# EAGLE design RFM22 Shield-v10 (EAGLE 9.0.1)
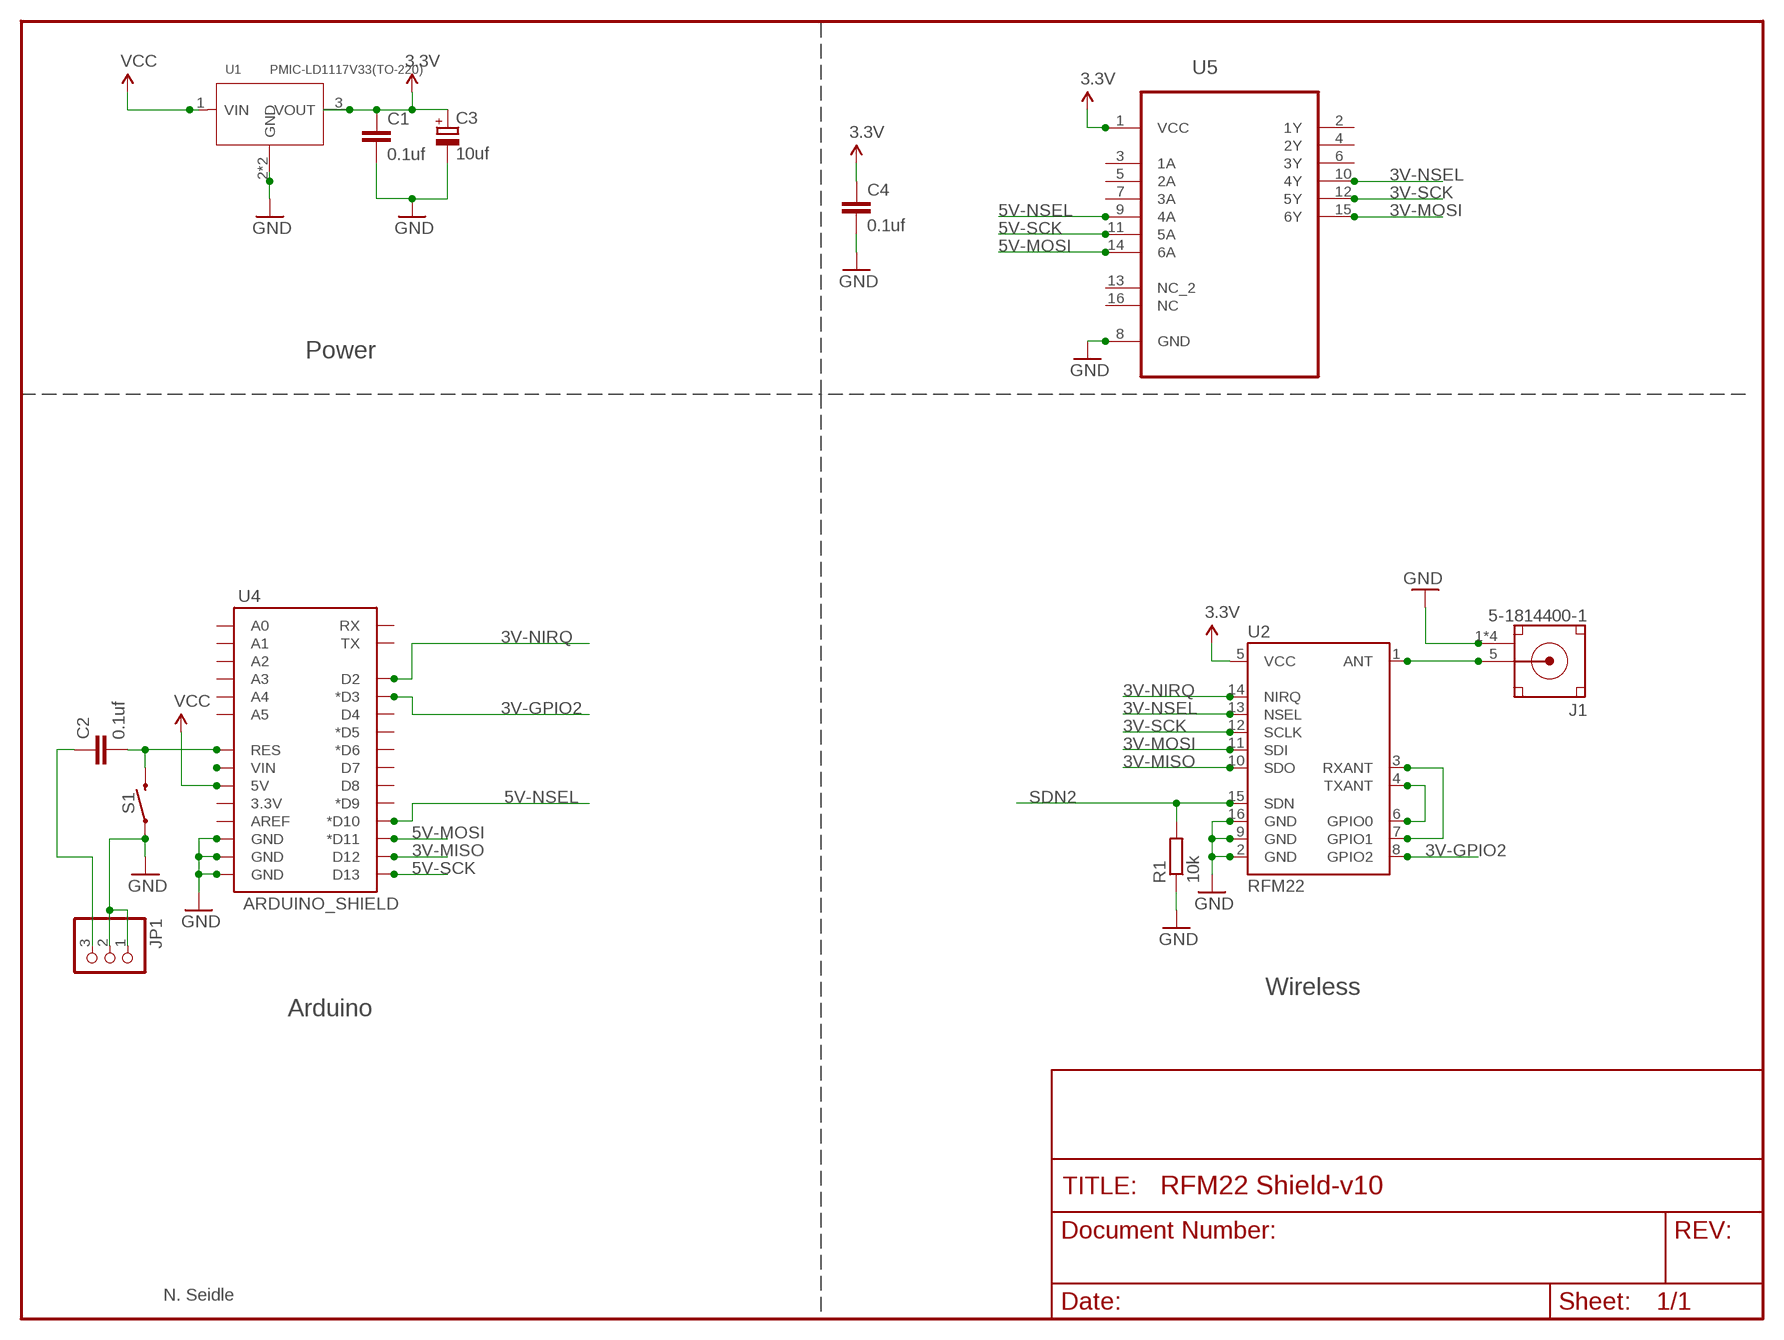
[diagram p0: schematic, sheet 1]

## Parts
C1  0.1uf  C-EU050-030X075  [C050-030X075]
C2  0.1uf  C-EU050-030X075  [C050-030X075]
C3  10uf  CPOL-EUE5-8.5  [E5-8,5]
C4  0.1uf  C-EU050-030X075  [C050-030X075]
J1  5-1814400-1  [CONN_5-1814400-1]
JP1  PINHD-1X3  [1X03]
R1  10k  R-EU_0207/10  [0207/10]
S1  MOMENTARY-SWITCH-SPST-PTH-6.0MM  [TACTILE_SWITCH_PTH_6.0MM]
U1  PMIC-LD1117V33(TO-220)  [TO-220]
U2  RFM22  RFM22SMD  [RFM22-XXX-S2]
U4  ARDUINO_SHIELD  ARDUINO_SHIELDNOHOLES  [DUEMILANOVE_SHIELD_NOHOLES]
U5  74HC4050N,652  [DIP254P762X420-16]

## Nets
3.3V: C1.1 C3.+ C4.1 U1.3(VOUT) U2.5(VCC) U5.1(VCC)
3V-GPIO2: U2.8(GPIO2) U4.D3(*D3)
3V-MISO: U2.10(SDO) U4.D12
3V-MOSI: U2.11(SDI) U5.15(6Y)
3V-NIRQ: U2.14(NIRQ) U4.D2
3V-NSEL: U2.13(NSEL) U5.10(4Y)
3V-SCK: U2.12(SCLK) U5.12(5Y)
5V-MOSI: U4.D11(*D11) U5.14(6A)
5V-NSEL: U4.D10(*D10) U5.9(4A)
5V-SCK: U4.D13 U5.11(5A)
ARST: C2.2 S1.3 U4.RES
GND: C1.2 C3.- C4.2 J1.1(GND) J1.2(GND) J1.3(GND) J1.4(GND) JP1.1 JP1.2 R1.1 S1.1 U1.2(GND) U1.HEAT(GND) U2.2(GND) U2.9(GND) U2.16(GND) U4.GND@0(GND) U4.GND@1(GND) U4.GND@2(GND) U5.8(GND)
N$1: J1.5(SIGNAL) U2.1(ANT)
N$2: U4.VIN
N$3: U2.4(TXANT) U2.6(GPIO0)
N$4: U2.3(RXANT) U2.7(GPIO1)
RES_HEAD: C2.1 JP1.3
SDN2: R1.2 U2.15(SDN)
VCC: U1.1(VIN) U4.5V
Unconnected: U4.3.3V U4.A0 U4.A1 U4.A2 U4.A3 U4.A4 U4.A5 U4.AREF U4.D4 U4.D5(*D5) U4.D6(*D6) U4.D7 U4.D8 U4.D9(*D9) U4.RX U4.TX U5.2(1Y) U5.3(1A) U5.4(2Y) U5.5(2A) U5.6(3Y) U5.7(3A) U5.13(NC_2) U5.16(NC)

## Notes on the sheet
- Power
- Wireless
- Arduino
- N. Seidle

## Library data of the parts
C1 C2 C4 = resistor:C-EU: CAPACITOR, European symbol
C3 = resistor:CPOL-EU: POLARIZED CAPACITOR, European symbol
J1 = 5-1814400-1:5-1814400-1: Conn SMA RCP 0Hz to 3GHz 50Ohm Solder RA Thru-Hole Gold Over Nickel Over Copper Bag; AVAILABILITY: Good; COMMENT: 5-1814400-1; DESCRIPTION: SMA R/A PCB Skt GZD; EU_ROHS_COMPLIANCE: Compliant; LINK: http://www.te.com/usa-en/product-5-1814400-1.html; MF: TE Connectivity; MP: 5-1814400-1; NUMBER_OF_POSITIONS: 1; PACKAGE: None; PRICE: 1.88 USD
JP1 = pinhead:PINHD-1X3: PIN HEADER
R1 = resistor:R-EU_: RESISTOR, European symbol
S1 = SparkFun-Switches:MOMENTARY-SWITCH-SPST: Momentary Switch (Pushbutton) - SPST Normally-open (NO) SPST momentary switches (buttons, pushbuttons). Variants PTH-12MM - 12mm square, through-hole Momentary Pushbutton Switch - 12mm Square <https://www.sparkfun.com/products/9190> (COM-09190) PTH-6.0MM, PTH-6.0MM-KIT - 6.0mm square, through-hole Mini Pushbutton Switch <https://www.sparkfun.com/products/97> (COM-00097) KIT package intended for soldering kit's - only one side of pads' copper is exposed. PTH-RIGHT-ANGLE-KIT - Right-angle, through-hole Right Angle Tactile Button <https://www.sparkfun.com/products/10791> - Used on SparkFun BigTime Watch Kit <https://www.sparkfun.com/products/11734> SMD-12MM - 12mm square, surface-mount Tactile Button - SMD (12mm) <https://www.sparkfun.com/products/12993> (COM-12993) Used on SparkFun PicoBoard <https://www.sparkfun.com/products/11888> SMD-4.5MM - 4.5mm Square Trackball Switch Used on SparkFun Blackberry Trackballer Breakout <https://www.sparkfun.com/products/13169> SMD-4.6MMX2.8MM - 4.60mm x 2.80mm, surface mount Used on SparkFun SAMD21 Mini Breakout <https://www.sparkfun.com/products/13664> SMD-5.2MM, SMD-5.2-REDUNDANT - 5.2mm square, surface-mount Mini Pushbutton Switch - SMD <https://www.sparkfun.com/products/8720> (COM-08720) Used on Arduino Pro Mini <https://www.sparkfun.com/products/11114> REDUNDANT package connects both switch circuits together SMD-6.0X3.5MM - 6.0 x 3.5mm, surface mount Momentary Reset Switch SMD <https://www.sparkfun.com/products/8229> (COM-08229) SMD-6.2MM-TALL - 6.2mm square, surface mount Tactile Button - SMD (6mm) <https://www.sparkfun.com/products/12992> Used on SparkFun Digital Sandbox <https://www.sparkfun.com/products/12651> SMD-RIGHT-ANGLE - Right-angle, surface mount Used on SparkFun Block for Intel® Edison - Arduino <https://www.sparkfun.com/products/13036>; PROD_ID: SWCH-08441; SF_SKU: COM-00097
U1 = PMIC-LD1117V33_TO-220_:PMIC-LD1117V33(TO-220): 310030025; AVAILABILITY: Good; DESCRIPTION: LD1117 Series 3.3 V 800 mA Low Drop Fixed Positive Voltage Regulator - TO-220; MF: STMicroelectronics; MP: LD1117V33; PACKAGE: TO-220 STMicroelectronics; PRICE: 0.29 USD
U2 = SparkFun:RFM22: Description: The RFM22 is a low-power, low cost radio that is capable of operating in the 434MHz and 900MHz open bands. It's frequency is software defined and there are some very good libraries written for it.
U4 = SparkFun:ARDUINO_SHIELD
U5 = 74HC4050N_652:74HC4050N,652: Hex high-to-low level shifter; AVAILABILITY: Warning; DESCRIPTION: 74HC Series 6 V Surface Mount Hex High-to-Low Level Shifter - DIP-16; MF: NXP Semiconductors; MP: 74HC4050N,652; PACKAGE: DIP-16 NXP Semiconductors; PRICE: 0.44 USD

## Board
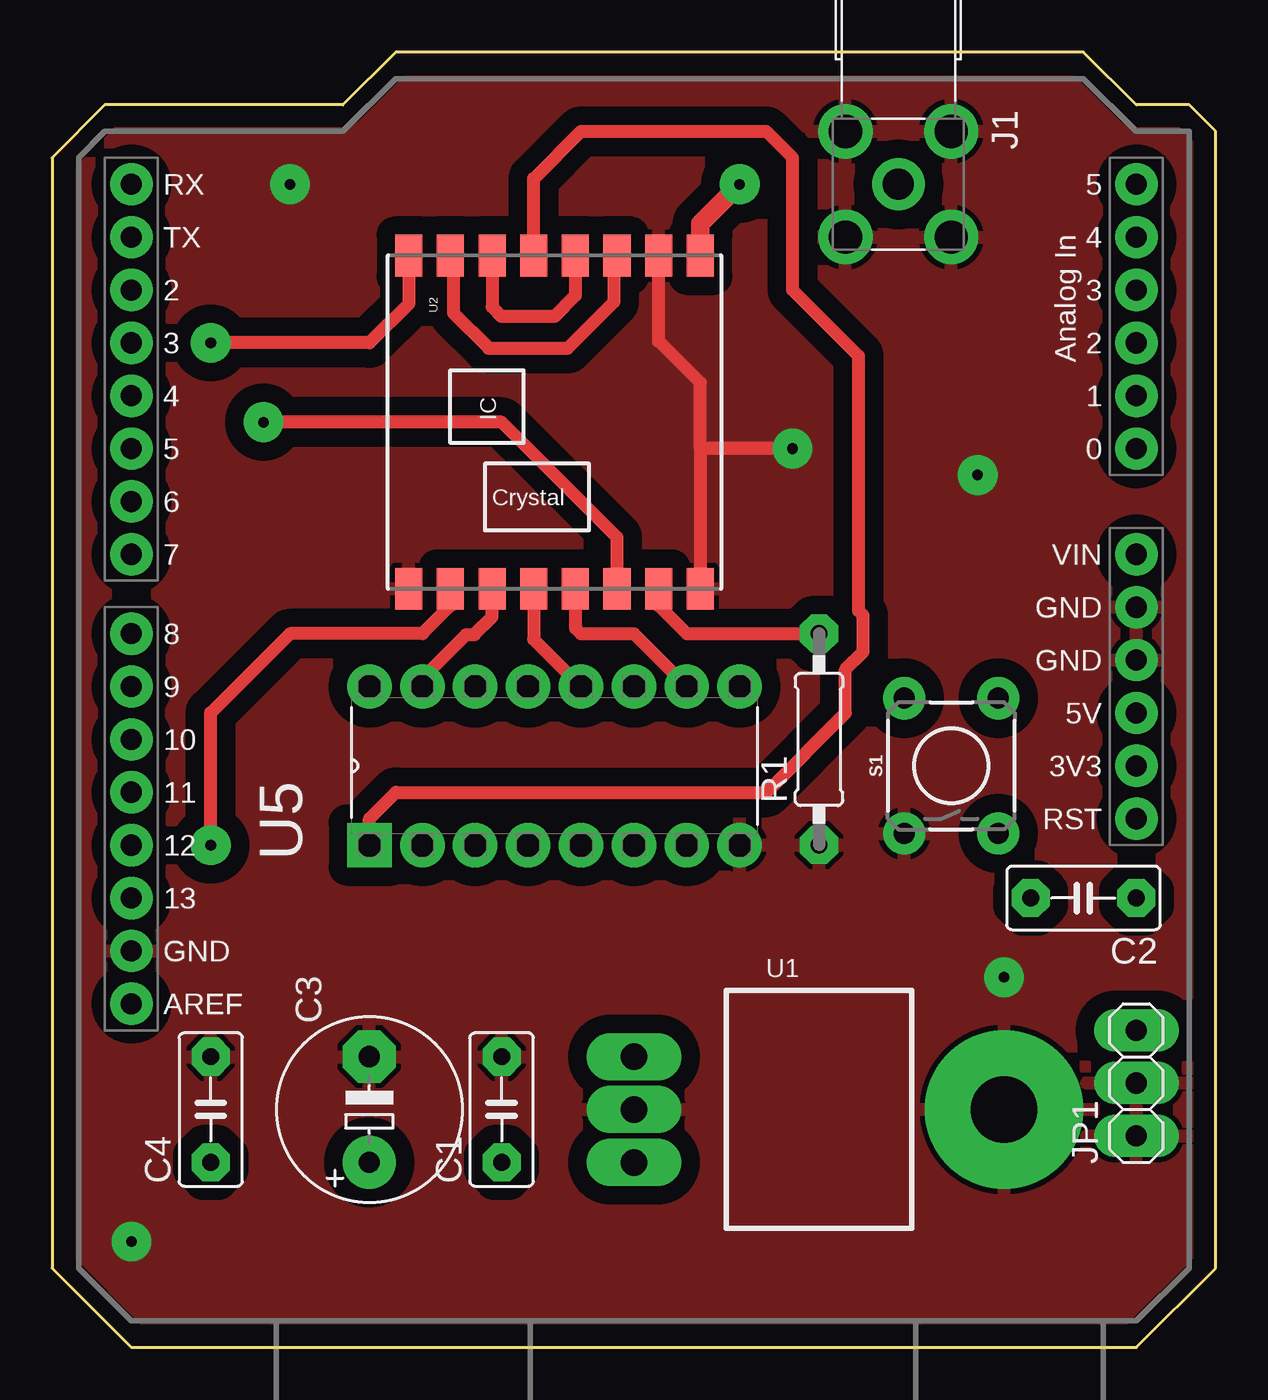
[diagram p1: board, top side]
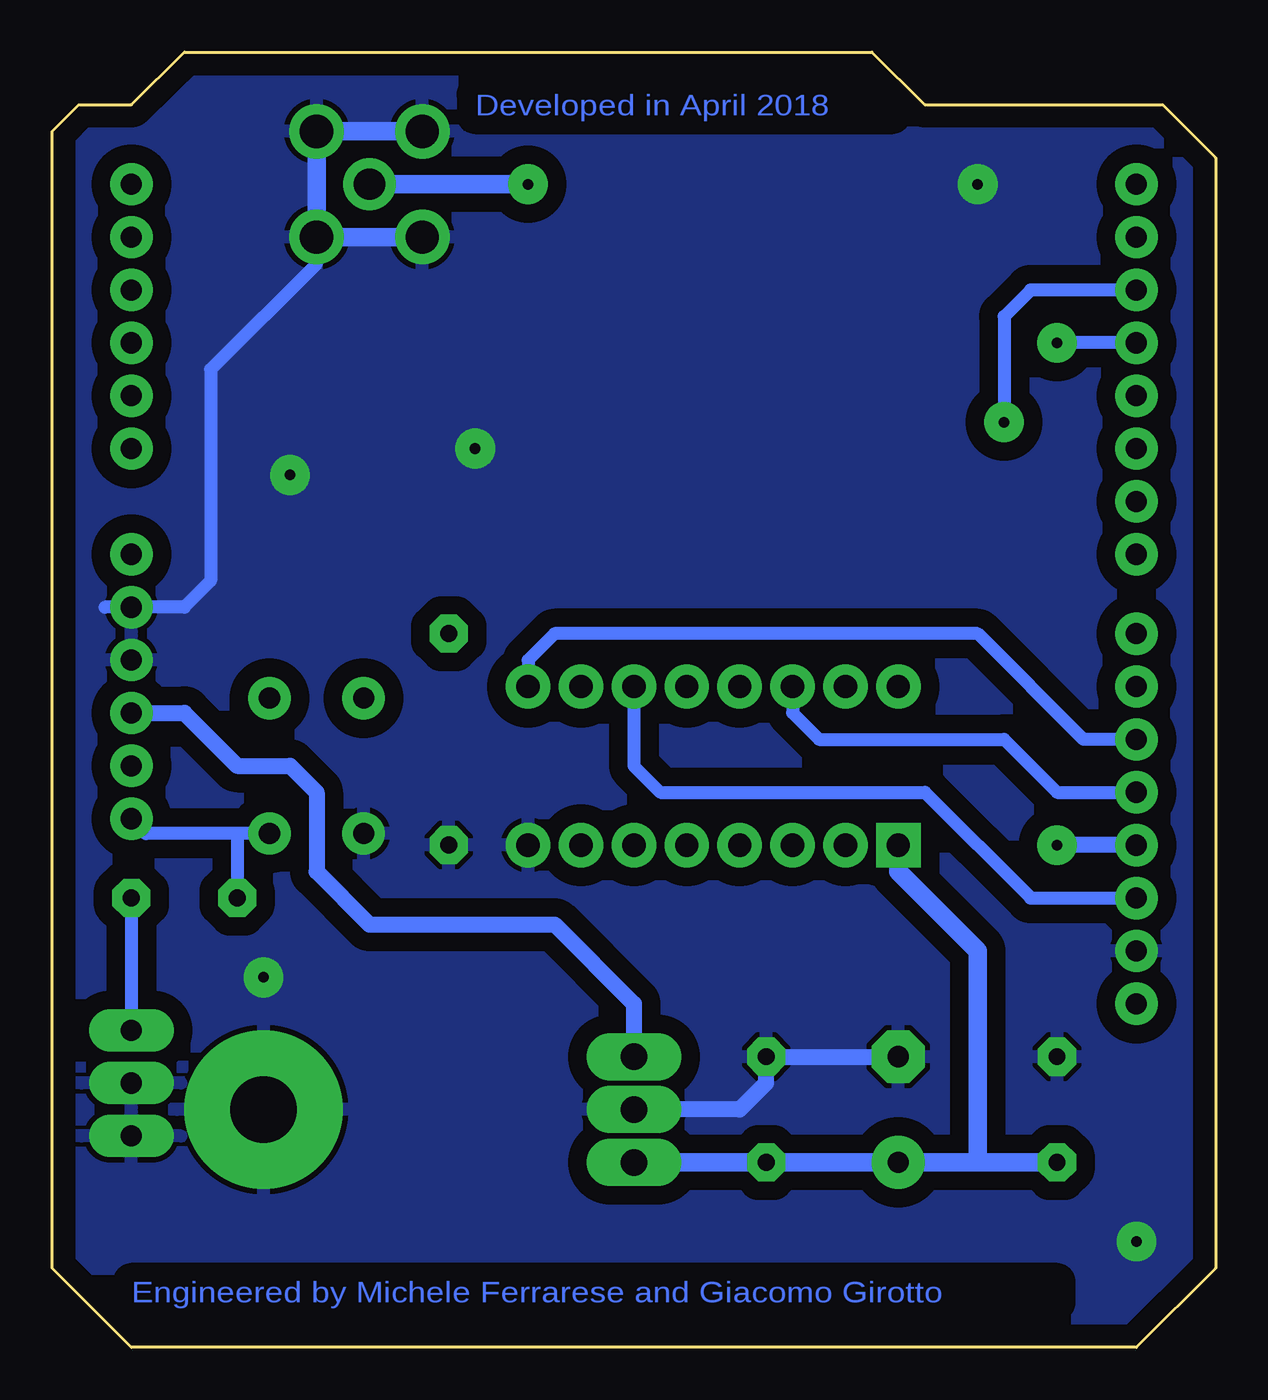
[diagram p2: board, bottom side, seen from below]

Size 55.88 x 62.23 mm. Coordinates in mm from the lower left corner, seen from the top.
Outline: 0,3.81 3.81,0 52.07,0 55.88,3.81 55.88,58.42 54.61,59.69 52.07,59.69 49.53,62.23 16.51,62.23 13.97,59.69 2.54,59.69 0,57.15 0,3.81
Copper layers (1*16): Top 0.035mm / dielectric 1.5mm / Bottom 0.035mm
Design rules "default *": minimum track width 6mil, minimum drill 0.35mm, track to track 35mil, track to pad 35mil, pad to pad 6mil, via to via 6mil, smd to smd 6mil, copper to edge 40mil, drill to drill 6mil, minimum pad ring 35mil, minimum via ring 8mil, stop-mask expansion 4mil, vias tented up to drill 0mil, thermal gap 10mil

### Footprints (pad centres in the part's own frame; a part is rotated, then mirrored left to right if it is on the bottom)
C050-030X075 = drill 0.813 octagon: 1 -2.54,0; 2 2.54,0
E5-8,5 = drill 1.016 pad 2.54: + -2.54,0 | drill 1.016 pad 2.54 octagon: - 2.54,0
CONN_5-1814400-1 = drill 1.6: 1 2.54,2.54; 2 -2.54,2.54; 3 -2.54,-2.54; 4 2.54,-2.54 | drill 1.5: 5 0,0
1X03 = drill 1.016 long: 1 -2.54,0; 2 0,0; 3 2.54,0
0207/10 = drill 0.813 octagon: 1 -5.08,0; 2 5.08,0
TACTILE_SWITCH_PTH_6.0MM = drill 1.016 pad 1.88: 1 -3.251,2.261; 2 3.251,2.261; 3 -3.251,-2.261; 4 3.251,-2.261
TO-220 = drill 1.27 pad 2.032 long: 1 -2.54,-11.43; 2 0,-11.43; 3 2.54,-11.43 | drill 3.2 pad 7.62: HEAT 0,6.35
RFM22-XXX-S2 = smd 2 x 1.3: 1 -8,7; 2 -8,5; 3 -8,3; 4 -8,1; 5 -8,-1; 6 -8,-3; 7 -8,-5; 8 -8,-7; 9 8,-7; 10 8,-5; 11 8,-3; 12 8,-1; 13 8,1; 14 8,3; 15 8,5; 16 8,7
DUEMILANOVE_SHIELD_NOHOLES = drill 1.016 pad 1.88: 3.3V 50.8,26.67; 5V 50.8,29.21; A0 50.8,41.91; A1 50.8,44.45; A2 50.8,46.99; A3 50.8,49.53; A4 50.8,52.07; A5 50.8,54.61; AREF 2.54,15.24; D2 2.54,49.53; D3 2.54,46.99; D4 2.54,44.45; D5 2.54,41.91; D6 2.54,39.37; D7 2.54,36.83; D8 2.54,33.02; D9 2.54,30.48; D10 2.54,27.94; D11 2.54,25.4; D12 2.54,22.86; D13 2.54,20.32; GND@0 50.8,31.75; GND@1 50.8,34.29; GND@2 2.54,17.78; RES 50.8,24.13; RX 2.54,54.61; TX 2.54,52.07; VIN 50.8,36.83
DIP254P762X420-16 = drill 1.118 square: 1 -7.62,17.78 | drill 1.118: 2 -7.62,15.24; 3 -7.62,12.7; 4 -7.62,10.16; 5 -7.62,7.62; 6 -7.62,5.08; 7 -7.62,2.54; 8 -7.62,0; 9 0,0; 10 0,2.54; 11 0,5.08; 12 0,7.62; 13 0,10.16; 14 0,12.7; 15 0,15.24; 16 0,17.78

### Placement (x,y rotation side)
C1  21.59,11.43 90 top
C2  49.53,21.59 180 top
C3  15.24,11.43 90 top
C4  7.62,11.43 90 top
J1  40.64,55.88 270 top
JP1  52.07,12.7 90 top
R1  36.83,29.21 90 top
S1  43.18,27.94 90 top
U1  39.37,11.43 270 top
U2  24.13,44.45 270 top
U4  1.27,1.27 0 top
U5  33.02,31.75 90 top

### Tracks (layer width: path | path; a pad name or v marks a point on that pad's centre or on a via)
3.3V
  Top 0.635: U5.1 15.24,25.4 16.51,26.67 34.29,26.67 38.1,30.48 38.1,32.56 38.95,33.41 38.95,35.17 38.73,35.38 38.73,47.62 35.56,50.8 35.56,57.15 34.29,58.42 25.4,58.42 23.13,56.15 U2.5
  Bottom 0.889: U1.3 C1.1 C3.+ 11.43,8.89 | 11.43,8.89 C4.1 | U5.1 15.24,22.86 11.43,19.05 11.43,8.89
3V-GPIO2  (via drill 0.51 pad 1.91)
  Top 0.635: v7.62,48.26 15.24,48.26 17.13,50.15 U2.8
  Bottom 0.635: U4.D3 v7.62,48.26
3V-MISO  (via drill 0.51 pad 1.91)
  Top 0.635: v7.62,24.13 7.62,30.48 11.43,34.29 17.78,34.29 19.13,35.64 U2.10
  Bottom 0.762: U4.D12 v7.62,24.13
3V-MOSI
  Top 0.152: 21.08,36.32 U2.11
  Top 0.635: U2.11 21.13,35.09 20.28,34.24 19.89,34.24 17.78,32.13 U5.15
3V-NIRQ  (via drill 0.51 pad 1.91)
  Top 0.635: v10.16,44.45 21.59,44.45 27.13,38.91 U2.14
  Bottom 0.635: U4.D2 8.89,50.8 10.16,49.53 v10.16,44.45
3V-NSEL
  Top 0.635: U2.13 25.13,34.56 25.4,34.29 27.94,34.29 U5.10
3V-SCK
  Top 0.635: U2.12 23.13,34.02 U5.12
5V-MOSI
  Bottom 0.635: U5.14 20.32,30.48 19.05,29.21 10.16,29.21 7.62,26.67 U4.D11
5V-NSEL
  Bottom 0.635: U4.D10 6.35,29.21 11.43,34.29 31.75,34.29 33.02,33.02 U5.9
5V-SCK
  Bottom 0.635: U5.11 27.94,27.94 26.67,26.67 13.97,26.67 8.89,21.59 U4.D13
ARST
  Bottom 0.635: S1.3 46.99,24.69 | 46.99,24.69 51.36,24.69 U4.RES | 46.99,24.69 C2.2
GND  (via drill 0.51 pad 1.91)
  Top 0.635: U2.2 29.13,48.34 31.13,46.34 31.13,43.18 | 31.13,43.18 U2.16 | 29.21,52.45 U2.2 | U2.2 29.13,52.21 28.99,52.07 28.99,52.45 U2.2 | v35.56,43.18 31.13,43.18
  Bottom 0.635: J1.1 43.18,52.07 48.26,46.99 48.26,36.83 49.53,35.56 U4.GND@1 53.34,35.56
  Bottom 0.762: U1.2 22.86,11.43 21.59,12.7 C1.2 C3.-
  Bottom 0.889: J1.3 J1.2 J1.1 J1.4
  other vias: 11.43,55.88 3.81,5.08 45.72,17.78 44.45,41.91
  pour Bottom (isolate 0.61, rank 3): 2.54,58.42 35.56,58.42 35.56,60.96 49.53,60.96 52.07,58.42 54.61,58.42 54.61,3.81 7.62,3.81 7.62,1.27 3.81,1.27 1.27,3.81 1.27,57.15
  pour Top (isolate 0.254, rank 4): 16.51,60.96 49.53,60.96 52.07,58.42 54.61,58.42 54.61,3.81 52.07,1.27 3.81,1.27 1.27,3.81 1.27,57.15 2.54,58.42 13.97,58.42
N$1  (via drill 0.51 pad 1.91)
  Top 0.889: U2.1 31.13,53.99 v33.02,55.88
  Bottom 0.889: v33.02,55.88 J1.5
N$3
  Top 0.635: U2.6 21.13,49.99 21.59,49.53 24.13,49.53 25.13,50.53 U2.4
N$4
  Top 0.635: U2.7 19.27,52.31 19.27,49.69 20.96,48.01 24.76,48.01 26.99,50.23 26.99,52.31 U2.3
RES_HEAD
  Bottom 0.635: C2.1 JP1.3
SDN2
  Top 0.635: U2.15 29.13,35.64 30.48,34.29 R1.2
VCC
  Bottom 0.762: U4.5V 49.53,30.48 46.99,27.94 44.45,27.94 43.18,26.67 43.18,22.86 40.64,20.32 31.75,20.32 27.94,16.51 U1.1

### Text on the board
Bottom: Developed in April 2018 | Engineered by Michele Ferrarese and Giacomo Girotto